# Altium schematic sheet Stabilizator.SchDoc
size A4
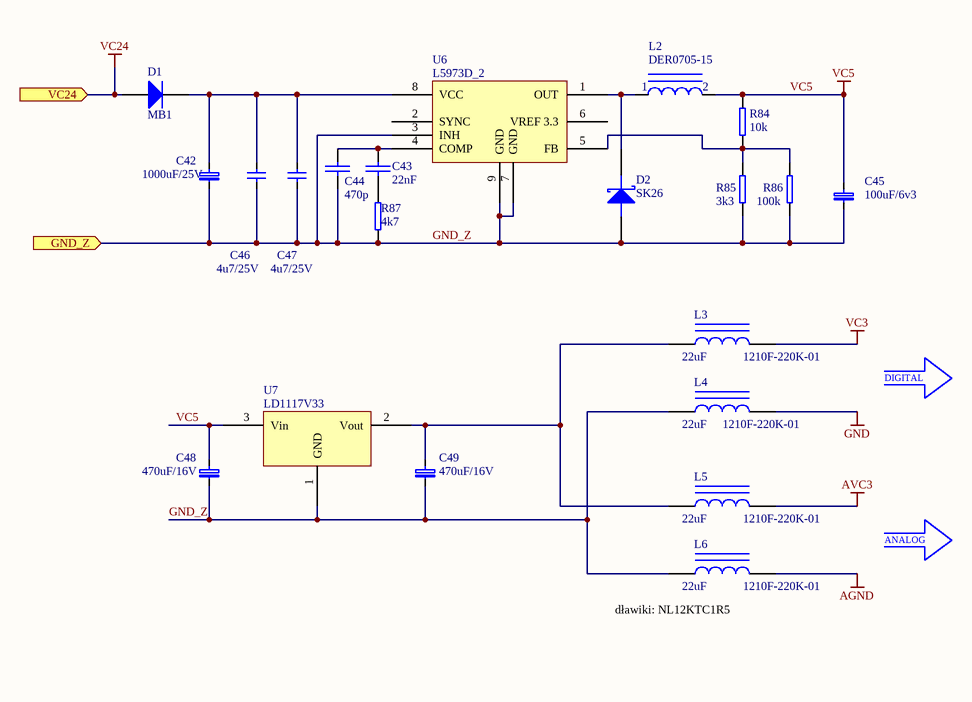
[diagram p0: Stabilizator.SchDoc]

## Parts
C42  1000uF/25V  [RB-.2/.4]
C43  22nF  [0603C]
C44  470p  [0603C]
C45  100uF/6v3  [CAP_C]
C46  4u7/25V  [1206]
C47  4u7/25V  [1206]
C48  470uF/16V  [CAP_D]
C49  470uF/16V  [CAP_D]
D1  MB1  [RD5]
D2  SK26  [RD5]
L2  DER0705-15  [DER0705_1]
L3  1210F-220K-01  value 22uF  [IND_1812]
L4  1210F-220K-01  value 22uF  [IND_1812]
L5  1210F-220K-01  value 22uF  [IND_1812]
L6  1210F-220K-01  value 22uF  [IND_1812]
R84  10k  [0603R]
R85  3k3  [0603R]
R86  100k  [0603R]
R87  4k7  [0603R]
U6  L5973D_2  [SO8_M]
U7  LD1117V33  [DPAK]

## Ports
GND_Z (in), VC24 (in)

## Nets
AGND: L6.2
AVC3: L5.2
GND: L4.2
VC3: L3.2
VC5: C45.2 C48.2 L2.2 R84.1 U7.3(Vin)
VC24: D1.A ; port VC24
GND_Z: C42.1 C44.2 C45.1 C46.1 C47.1 C48.1 C49.1 D2.A L4.1 L6.1 R85.2 R86.2 R87.2 U6.3(INH) U6.7(GND) U6.9(GND) U7.1(GND) ; port GND_Z
NetC42_2: C42.2 C46.2 C47.2 D1.K U6.8(VCC)
NetC43_1: C43.1 R87.1
NetC43_2: C43.2 C44.1 U6.4(COMP)
NetC49_2: C49.2 L3.1 L5.1 U7.2(Vout)
NetD2_K: D2.K L2.1 U6.1(OUT)
NetR84_2: R84.2 R85.1 R86.1 U6.5(FB)

Not connected (* = marked no-connect by the designer): U6 2(SYNC) 6(VREF_3.3)

## Notes on the sheet
- DIGITAL
- ANALOG
- (near L6) dławiki: NL12KTC1R5

## Library data of the parts
C42 C45 C48 C49 = CAP_TANTAL_SMD: KONDENSATOR ELEKTROLITYCZNY TANTALOWY SMD
C43 C44 = CAP: Capacitor
C46 C47 = CAP
D1 = Diode: Default Diode; Published: 8-Jun-2000; LatestRevisionDate: 17-Jul-2002; LatestRevisionNote: Re-released for DXP Platform.; PackageVersion: Sep-1996; PackageReference: SMC; Publisher: Altium Limited; PackageDescription: DO-214-AB/SMC; 2 C-Bend Leads; Body 7.9 x 5.9 mm, inc. leads (LxW); Code_JEDEC: DO-214-AB
D2 = DIODE SCHOTTKY: Schottky Diode
L2 = CEWKA_1
L3-L6 = Inductor Iron: Magnetic-Core Inductor; Dostawca.Symbol: DL1210-0.47; Dostawca: TME; Published: 24-Mar-1999; LatestRevisionDate: 17-Jul-2002; LatestRevisionNote: Re-released for DXP Platform.; PackageReference: AXIAL-0.9; Publisher: Altium Limited
R84-R87 = RES3